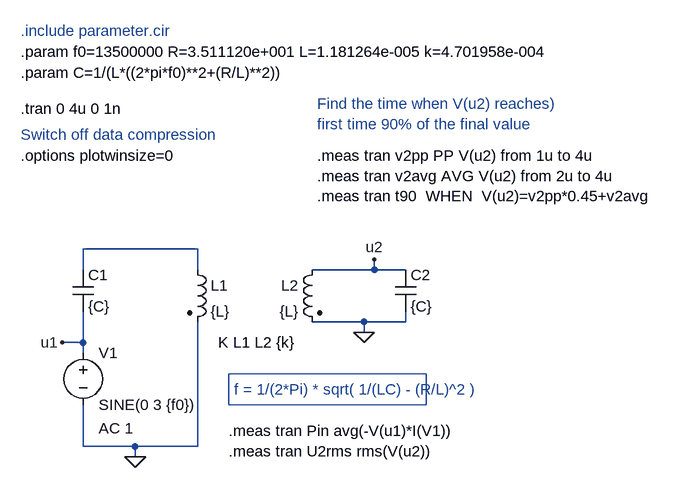
[diagram p0: schematic Kopplung1.asc]
Kopplung1.asc, the LTspice schematic file:
Version 4
SHEET 1 1184 680
WIRE -112 144 -112 112
WIRE -112 256 -144 256
WIRE -112 256 -112 208
WIRE -112 272 -112 256
WIRE -112 416 -112 352
WIRE -32 416 -112 416
WIRE -32 432 -32 416
WIRE 64 112 -112 112
WIRE 64 144 64 112
WIRE 64 416 -32 416
WIRE 64 416 64 224
WIRE 320 224 240 224
WIRE 320 240 320 224
WIRE 336 144 240 144
WIRE 336 144 336 128
WIRE 384 144 336 144
WIRE 384 224 320 224
WIRE 384 224 384 208
FLAG 320 240 0
FLAG -32 432 0
FLAG 336 128 u2
FLAG -144 256 u1
SYMBOL ind2 48 128 R0
SYMATTR InstName L1
SYMATTR Value {L}
SYMATTR Type ind
SYMATTR SpiceLine Rser={R}
SYMBOL ind2 256 128 M0
SYMATTR InstName L2
SYMATTR Value {L}
SYMATTR Type ind
SYMATTR SpiceLine Rser={R}
SYMBOL cap 368 144 R0
SYMATTR InstName C2
SYMATTR Value {C}
SYMBOL cap -128 144 R0
SYMATTR InstName C1
SYMATTR Value {C}
SYMBOL voltage -112 256 R0
WINDOW 123 24 132 Left 0
WINDOW 39 0 0 Left 0
SYMATTR Value2 AC 1
SYMATTR InstName V1
SYMATTR Value SINE(0 3 {f0})
TEXT 96 256 Left 0 !K L1 L2 {k}
TEXT -208 -160 Left 0 !.param C=1/(L*((2*pi*f0)**2+(R/L)**2))
TEXT 112 392 Left 0 !.meas tran Pin avg(-V(u1)*I(V1))\n.meas tran U2rms rms(V(u2))
TEXT 120 328 Left 0 ;f = 1/(2*Pi) * sqrt( 1/(LC) - (R/L)^2 )
TEXT -208 -224 Left 0 ;.include parameter.cir
TEXT -208 -104 Left 0 !.tran 0 4u 0 1n
TEXT 248 -32 Left 0 !.meas tran v2pp PP V(u2) from 1u to 4u\n.meas tran v2avg AVG V(u2) from 2u to 4u\n.meas tran t90  WHEN  V(u2)=v2pp*0.45+v2avg
TEXT -208 -32 Left 0 !.options plotwinsize=0
TEXT 248 -112 Left 0 ;Find the time when V(u2) reaches) \nfirst time 90% of the final value
TEXT -208 -192 Left 0 !.param f0=13500000 R=3.511120e+001 L=1.181264e-005 k=4.701958e-004
TEXT -208 -64 Left 0 ;Switch off data compression
RECTANGLE Normal 416 352 112 304

The netlist it stands for:
* Kopplung1.asc
L1 N001 0 {L} Rser={R}
L2 u2 0 {L} Rser={R}
C2 u2 0 {C}
C1 N001 u1 {C}
V1 u1 0 SINE(0 3 {f0}) AC 1
K L1 L2 {k}
.param C=1/(L*((2*pi*f0)**2+(R/L)**2))
.meas tran Pin avg(-V(u1)*I(V1))
.meas tran U2rms rms(V(u2))
* f = 1/(2*Pi) * sqrt( 1/(LC) - (R/L)^2 )
* .include parameter.cir
.tran 0 4u 0 1n
.meas tran v2pp PP V(u2) from 1u to 4u
.meas tran v2avg AVG V(u2) from 2u to 4u
.meas tran t90  WHEN  V(u2)=v2pp*0.45+v2avg
.options plotwinsize=0
* Find the time when V(u2) reaches)
* first time 90% of the final value
.param f0=13500000 R=3.511120e+001 L=1.181264e-005 k=4.701958e-004
* Switch off data compression
.backanno
.end